# EAGLE design 5vDC (EAGLE 9.6.2)
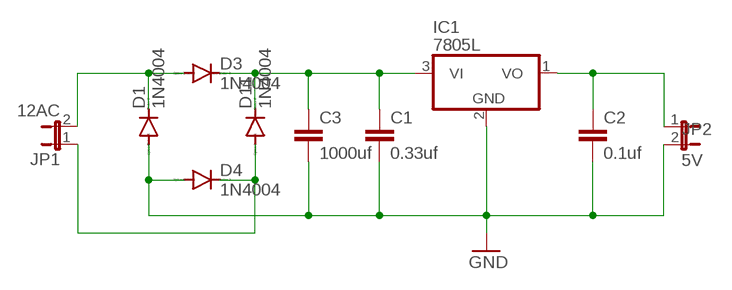
[diagram p0: schematic, sheet 1]

## Parts
C1  0.33uf  C2,5-3  [C2.5-3]
C2  0.1uf  C2,5-3  [C2.5-3]
C3  1000uf  C2,5-3  [C2.5-3]
D1  1N4004  [DO41-10]
D3  1N4004  [DO41-10]
D4  1N4004  [DO41-10]
D11  1N4004  [DO41-10]
IC1  7805L  [TO92]
JP1  12AC  JP1E  [JP1]
JP2  5V  JP1E  [JP1]

## Nets
GND: C1.2 C2.2 C3.2 D1.A D4.A IC1.2(GND) JP2.2
N$2: D1.C D3.A JP1.2
N$4: C1.1 C3.1 D3.C D11.C IC1.3(VI)
N$5: C2.1 IC1.1(VO) JP2.1
N$7: D4.C D11.A JP1.1

## Library data of the parts
C1-C3 = capacitor-wima:C: CAPACITOR naming: grid - package width
D1 D3 D4 D11 = diode:1N4004: DIODE general purpose rectifier, 1 A
IC1 = linear:78*: Positive VOLTAGE REGULATOR Source: http://cache.national.com/ds/LM/LM78L05.pdf http://www.fairchildsemi.com/ds/LM/LM7805.pdf
JP1 JP2 = jumper:JP1E: JUMPER

## Board
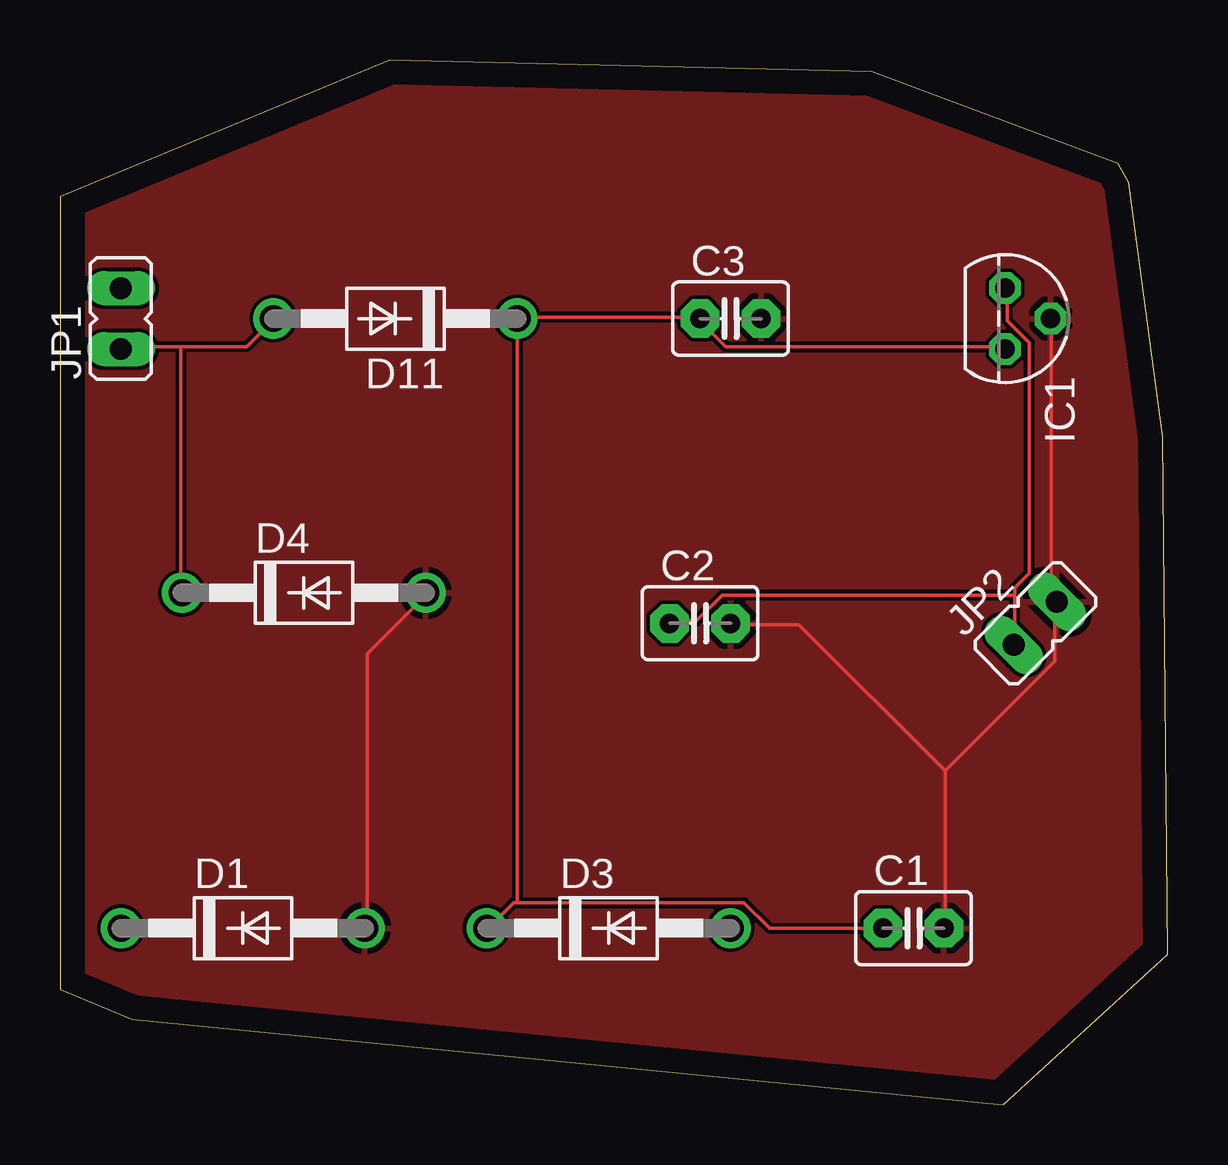
[diagram p1: board, top side]
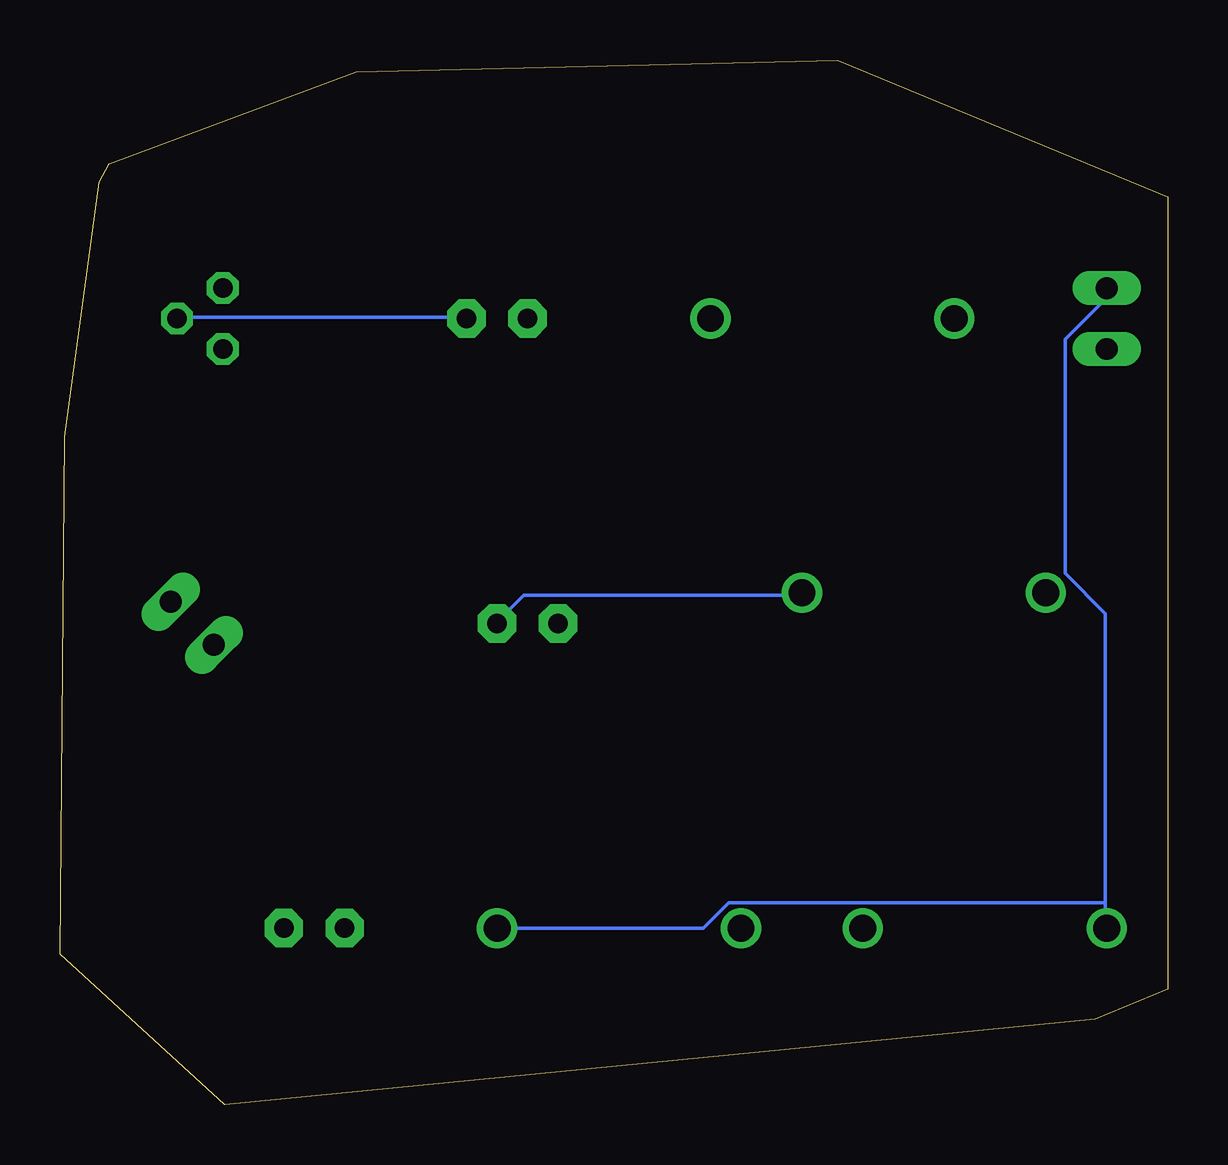
[diagram p2: board, bottom side, seen from below]

Size 46.15 x 43.53 mm. Coordinates in mm from the lower left corner, seen from the top.
Outline: 13.74,43.53 33.82,43.04 44.1,39.22 44.52,38.43 45.95,27.83 46.15,6.27 39.3,0 3.02,3.57 0,4.82 0,37.84 13.74,43.53
Outline: 13.74,43.53 13.74,43.53
Copper layers (1*16): Top 0.035mm / dielectric 1.5mm / Bottom 0.035mm
Design rules "default": minimum track width 6mil, minimum drill 0.35mm, track to track 6mil, track to pad 6mil, pad to pad 6mil, via to via 6mil, smd to smd 6mil, copper to edge 40mil, drill to drill 6mil, minimum pad ring 10mil, minimum via ring 8mil, stop-mask expansion 4mil, vias tented up to drill 0mil, thermal gap 10mil

### Footprints (pad centres in the part's own frame; a part is rotated, then mirrored left to right if it is on the bottom)
C2.5-3 = drill 0.813 pad 1.6 octagon: 1 -1.27,0; 2 1.27,0
DO41-10 = drill 1.118: A 5.08,0; C -5.08,0
TO92 = drill 0.813 octagon: 1 -1.27,0; 2 0,1.905; 3 1.27,0
JP1 = drill 0.914 long: 1 0,-1.27; 2 0,1.27

### Placement (x,y rotation side)
C1  35.56,7.36 0 top
C2  26.67,20.06 0 top
C3  27.94,32.76 0 top
D1  7.62,7.36 0 top
D3  22.86,7.36 0 top
D4  10.16,21.33 0 top
D11  13.97,32.76 180 top
IC1  39.37,32.76 270 top
JP1  2.54,32.76 0 top
JP2  40.64,20.06 315 top

### Tracks (layer width: path | path; a pad name or v marks a point on that pad's centre or on a via)
GND
  Top 0.152: D1.A 12.8,7.36 12.8,18.79 15.24,21.23 D4.A | IC1.2 41.3,32.66 41.3,21.23 41.45,21.08 JP2.2 41.45,20.93 41.45,18.49 36.88,13.92 | 36.88,13.92 36.88,7.36 C1.2 | 36.88,13.92 30.79,20.01 28.04,20.01 C2.2
  Bottom 0.152: C3.2 29.26,32.81 41.15,32.81 IC1.2 | D4.A 15.24,21.23 26.82,21.23 27.89,20.16 C2.2
  pour Top: 1.27,46.73 44.45,46.73 46.99,44.19 49.53,41.65 49.53,-2.8 5.08,-2.8 -2.54,4.82 -2.54,44.19 0,46.73
N$2
  Bottom 0.152: 2.59,8.43 2.59,7.36 D1.C | 2.59,8.43 2.59,20.47 4.27,22.15 4.27,31.9 2.59,33.58 2.59,34.03 JP1.2 | D3.A 19.36,7.36 18.29,8.43 2.59,8.43
N$4
  Top 0.152: C1.1 29.57,7.36 28.5,8.43 19.05,8.43 | 19.05,8.43 18.9,8.43 17.83,7.36 D3.C | IC1.3 39.32,31.59 27.74,31.59 26.67,32.66 C3.1 26.67,32.81 19.05,32.81 D11.C 19.05,8.43
N$5
  Top 0.152: 39.78,21.23 39.78,19.25 JP2.1 | 39.78,21.23 39.78,21.54 40.39,22.15 40.39,31.75 39.47,32.66 39.47,34.03 IC1.1 | 39.78,21.23 27.58,21.23 26.52,20.16 25.45,20.16 C2.1
N$7
  Top 0.152: 5.03,31.59 7.77,31.59 8.84,32.66 D11.A | 5.03,31.59 2.59,31.59 JP1.1 | 5.03,31.59 5.03,21.38 D4.C